# EAGLE design h2oiq_v4 (EAGLE 6.3)
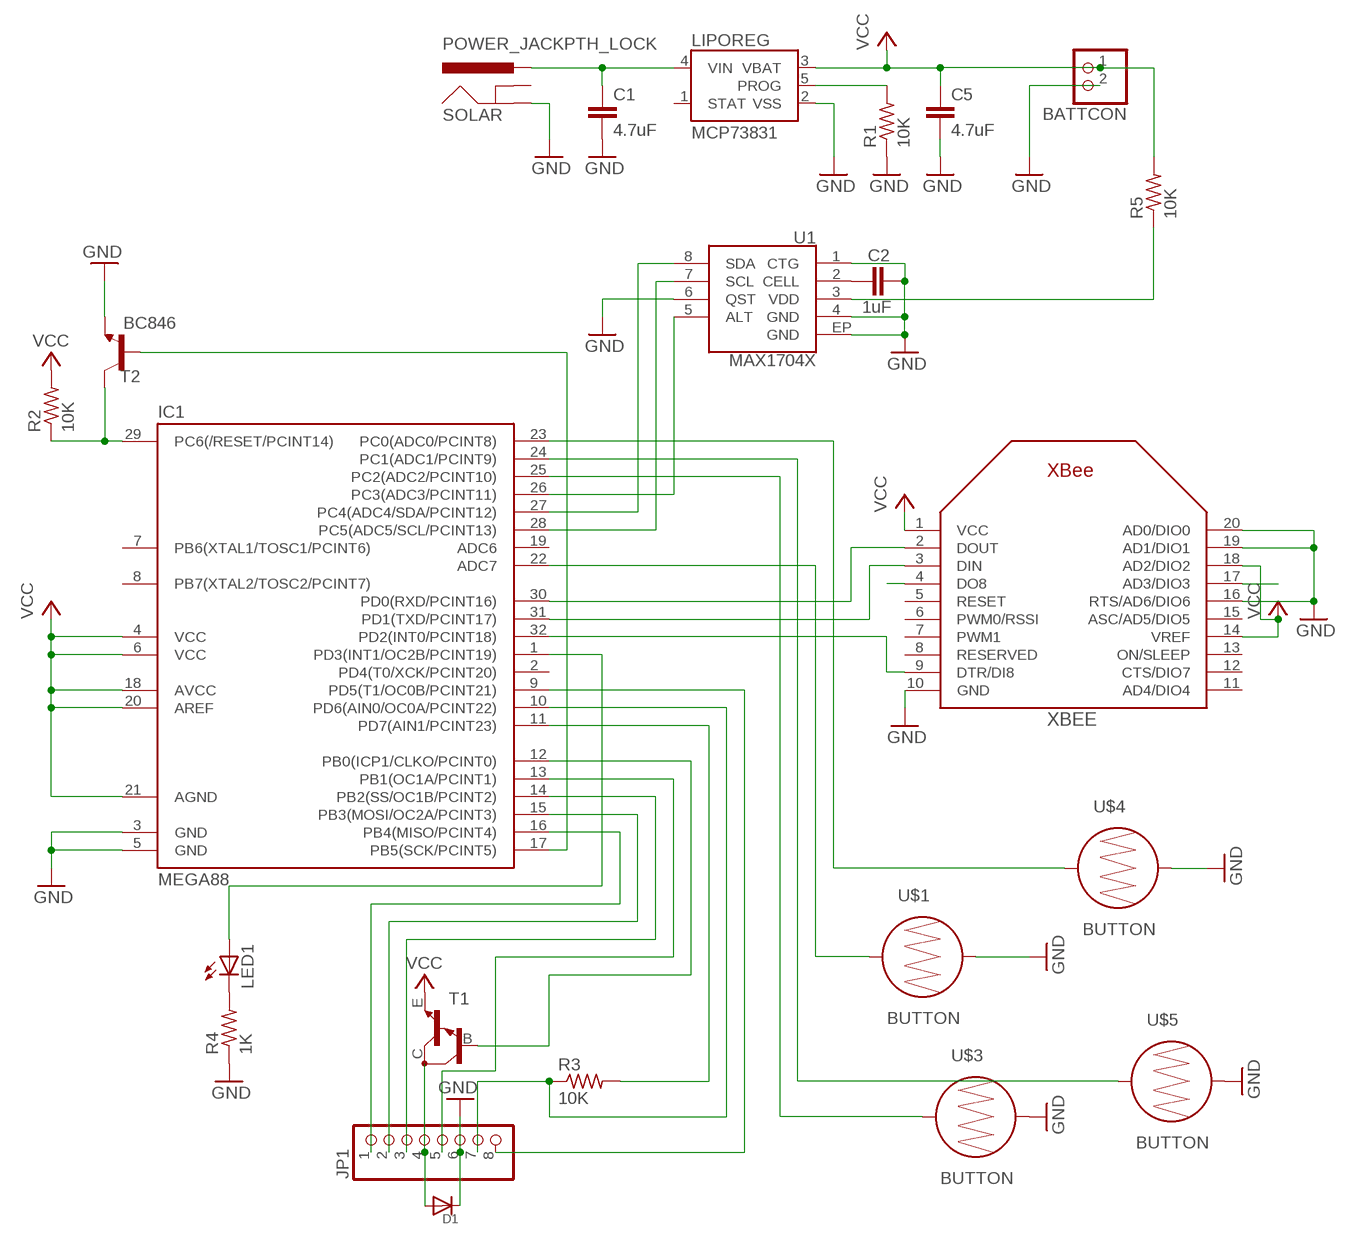
[diagram p0: schematic, sheet 1]

## Parts
BATTCON  JST_2PIN-SMT  [JST-PH-2-SMT]
C1  4.7uF  CAP0402-CAP  [0402-CAP]
C2  1uF  CAP0402-CAP  [0402-CAP]
C5  4.7uF  CAP0402-CAP  [0402-CAP]
D1  DIODESMA  [SMADIODE]
IC1  MEGA88  MEGA48/88/168-MU  [MLF32]
JP1  PINHD-1X8LOCK  [1X08-LOCK]
LED1  LED  [SMARTLED-TTW]
LIPOREG  MCP73831  [SOT23-5]
R1  10K  R-US_R0603  [R0603]
R2  10K  R-US_R0603  [R0603@1]
R3  10K  R-US_R0603  [R0603]
R4  1K  R-US_R0603  [R0603@1]
R5  10K  R-US_R0603  [R0603@1]
SOLAR  POWER_JACKPTH_LOCK  [POWER_JACK_PTH_LOCK]
T1  MMBTA13LT1-NPN_DARL-SOT23-BEC  [SOT23-BEC]
T2  BC846  [SOT23]
U1  MAX1704X  [TDFN-8]
U$1  BUTTON  BUTTON-CONDUCTIVESMD  [BUTTON-CONDUCTIVE]
U$3  BUTTON  BUTTON-CONDUCTIVESMD  [BUTTON-CONDUCTIVE]
U$4  BUTTON  BUTTON-CONDUCTIVESMD  [BUTTON-CONDUCTIVE]
U$5  BUTTON  BUTTON-CONDUCTIVESMD  [BUTTON-CONDUCTIVE]
XBEE  XBEE  [XBEE]

## Nets
GND: BATTCON.2 C1.2 C2.2 C5.2 D1.C IC1.3(GND) IC1.5(GND) JP1.6 LIPOREG.2(VSS) R1.1 R4.1 SOLAR.GND T2.2(E) U1.1(CTG) U1.4(GND) U1.6(QST) U1.EP(GND) U$1.2 U$3.2 U$4.2 U$5.2 XBEE.10(GND) XBEE.16(RTS/AD6/DIO6) XBEE.19(AD1/DIO1) XBEE.20(AD0/DIO0)
MAX1704ALT: IC1.26(PC3(ADC3/PCINT11)) U1.5(ALT)
MAX1704VDD: R5.1 U1.3(VDD) XBEE.4(DO8)
N$1: C1.1 LIPOREG.4(VIN) SOLAR.PWR
N$2: LIPOREG.5(PROG) R1.2
N$3: IC1.29(PC6(/RESET/PCINT14)) R2.1 T2.3(C)
N$4: IC1.12(PB0(ICP1/CLKO/PCINT0)) T1.B
N$6: IC1.27(PC4(ADC4/SDA/PCINT12)) U1.8(SDA)
N$7: IC1.28(PC5(ADC5/SCL/PCINT13)) U1.7(SCL)
N$8: IC1.32(PD2(INT0/PCINT18)) XBEE.9(DTR/DI8)
N$9: IC1.15(PB3(MOSI/OC2A/PCINT3)) JP1.2
N$10: IC1.1(PD3(INT1/OC2B/PCINT19)) LED1.A@1(A)
N$11: LED1.C@1(C) R4.2
N$12: IC1.23(PC0(ADC0/PCINT8)) U$4.1
N$13: IC1.14(PB2(SS/OC1B/PCINT2)) JP1.3
N$14: IC1.16(PB4(MISO/PCINT4)) JP1.1
N$15: IC1.10(PD6(AIN0/OC0A/PCINT22)) JP1.7 R3.1
N$16: IC1.25(PC2(ADC2/PCINT10)) U$3.1
N$17: IC1.30(PD0(RXD/PCINT16)) XBEE.2(DOUT)
N$18: IC1.22(ADC7) U$1.1
N$19: IC1.31(PD1(TXD/PCINT17)) XBEE.3(DIN)
N$20: IC1.24(PC1(ADC1/PCINT9)) U$5.1
N$23: C2.1 U1.2(CELL)
N$26: IC1.13(PB1(OC1A/PCINT1)) JP1.5
N$27: IC1.11(PD7(AIN1/PCINT23)) R3.2
N$28: IC1.9(PD5(T1/OC0B/PCINT21)) JP1.8
N$29: IC1.17(PB5(SCK/PCINT5)) T2.1(B)
SERVOACT: D1.A JP1.4 T1.C XBEE.17(AD3/DIO3)
VCC: BATTCON.1 C5.1 IC1.4(VCC) IC1.6(VCC) IC1.18(AVCC) IC1.20(AREF) IC1.21(AGND) LIPOREG.3(VBAT) R2.2 R5.2 T1.E XBEE.1(VCC) XBEE.14(VREF) XBEE.18(AD2/DIO2)
Unconnected: IC1.2(PD4(T0/XCK/PCINT20)) IC1.7(PB6(XTAL1/TOSC1/PCINT6)) IC1.8(PB7(XTAL2/TOSC2/PCINT7)) IC1.19(ADC6) LIPOREG.1(STAT) SOLAR.GNDBREAK XBEE.5(RESET) XBEE.6(PWM0/RSSI) XBEE.7(PWM1) XBEE.8(RESERVED) XBEE.11(AD4/DIO4) XBEE.12(CTS/DIO7) XBEE.13(ON/SLEEP) XBEE.15(ASC/AD5/DIO5)

## Library data of the parts
BATTCON = adafruit:JST_2PIN: JST 2-Pin Connectors of various flavors SMT-RA (S2B-PH-SM4) 4UConnector #17311 SMT (B2B-PH-SM4) THM-RA (S2B-PH) THM (B2B-PH)
C1 C2 C5 = SparkFun:CAP: Capacitor Standard 0603 ceramic capacitor, and 0.1" leaded capacitor.
D1 = adafruit:DIODE: Diode SMADIODE - SMA Surface Mount Package 20V 1A Schottky Diode Digikey: 641-1014-6-ND DO-1N4148 - Through Hole Small Current Diode SOD-123 20V 1 A (.5mV Vf) Schottky Diode - Digikey: MBRX120TPMSCT-ND SOD-323 10V 570mA (.38mV Vf, 3ns) Schottky Diode - Digikey: ZLLS410CT-ND SOD-523 30V 30mA Schottky Diode (RB751S-40TE61) - Digikey: RB751S-40TE61CT-ND SOT23-R/W - SOT23 Package (R = Solder Paste/Reflow Ovens, W = Hand-Soldering) BAT54Film 40V 300mA - Digikey: 497-7162-1-ND
IC1 = avr-7:MEGA48/88/168
JP1 = adafruit:PINHD-1X8: PIN HEADER
LED1 = led:LED: LED OSRAM: - CHIPLED LG R971, LG N971, LY N971, LG Q971, LY Q971, LO R971, LY R971 LH N974, LH R974 LS Q976, LO Q976, LY Q976 LO Q996 - Hyper CHIPLED LW Q18S LB Q993, LB Q99A, LB R99A - SideLED LS A670, LO A670, LY A670, LG A670, LP A670 LB A673, LV A673, LT A673, LW A673 LH A674 LY A675 LS A676, LA A676, LO A676, LY A676, LW A676 LS A679, LY A679, LG A679 - Hyper Micro SIDELED® LS Y876, LA Y876, LO Y876, LY Y876 LT Y87S - SmartLED LW L88C, LW L88S LB L89C, LB L89S, LG L890 LS L89K, LO L89K, LY L89K LS L896, LA L896, LO L896, LY L896 - TOPLED LS T670, LO T670, LY T670, LG T670, LP T670 LSG T670, LSP T670, LSY T670, LOP T670, LYG T670 LG T671, LOG T671, LSG T671 LB T673, LV T673, LT T673, LW T673 LH T674 LS T676, LA T676, LO T676, LY T676, LB T676, LH T676, LSB T676, LW T676 LB T67C, LV T67C, LT T67C, LS T67K, LO T67K, LY T67K, LW E67C LS E67B, LA E67B, LO E67B, LY E67B, LB E67C, LV E67C, LT E67C LW T67C LS T679, LY T679, LG T679 LS T770, LO T770, LY T770, LG T770, LP T770 LB T773, LV T773, LT T773, LW T773 LH T774 LS E675, LA E675, LY E675, LS T675 LS T776, LA T776, LO T776, LY T776, LB T776 LHGB T686 LT T68C, LB T68C - Hyper Mini TOPLED® LB M676 - Mini TOPLED Santana® LG M470 LS M47K, LO M47K, LY M47K Source: http://www.osram.convergy.de LUXEON: - LUMILED® LXK2-PW12-R00, LXK2-PW12-S00, LXK2-PW14-U00, LXK2-PW14-V00 LXK2-PM12-R00, LXK2-PM12-S00, LXK2-PM14-U00 LXK2-PE12-Q00, LXK2-PE12-R00, LXK2-PE12-S00, LXK2-PE14-T00, LXK2-PE14-U00 LXK2-PB12-K00, LXK2-PB12-L00, LXK2-PB12-M00, LXK2-PB14-N00, LXK2-PB14-P00, LXK2-PB14-Q00 LXK2-PR12-L00, LXK2-PR12-M00, LXK2-PR14-Q00, LXK2-PR14-R00 LXK2-PD12-Q00, LXK2-PD12-R00, LXK2-PD12-S00 LXK2-PH12-R00, LXK2-PH12-S00 LXK2-PL12-P00, LXK2-PL12-Q00, LXK2-PL12-R00 Source: www.luxeon.com KINGBRIGHT: KA-3528ASYC Source: www.kingbright.com
LIPOREG = SparkFun:MCP73831: Microchip's MCP73831 Miniature single cell, fully integrated Li-Ion, Li-polymer charge management controller http://ww1.microchip.com/downloads/en/DeviceDoc/21984a.pdf
R1 R3 = resistor:R-US_: RESISTOR, American symbol
R2 R4 R5 = rcl:R-US_: RESISTOR, American symbol
SOLAR = SparkFun:POWER_JACK: Power Jack This is the standard 5.5mm barrel jack for power. The PTH is the most common, proven, reliable, footprint. All others are experimental. The Slot footprint only works if the mill layer is transmitted to the PCB fab house so be warned. Spark Fun Electronics SKU : PRT-00119. Mating wall wart : TOL-00298 (and others)
T1 = transistor:*-NPN_DARL-: NPN Darlington Transistor
T2 = transistor:BC846: NPN TRANSISTOR
U1 = SparkFun:MAX1704X: MAX17043/MAX17044: Battery Fuel Guage (43 is 1cell, 44 is 2cell)
U$1 U$3-U$5 = SparkFun:BUTTON-CONDUCTIVE: Conductive Button Used with rubber key pads. This one was designed and proven to work with the PolyCase Key FOB enclosures.
XBEE = adafruit:XBEE

## Board
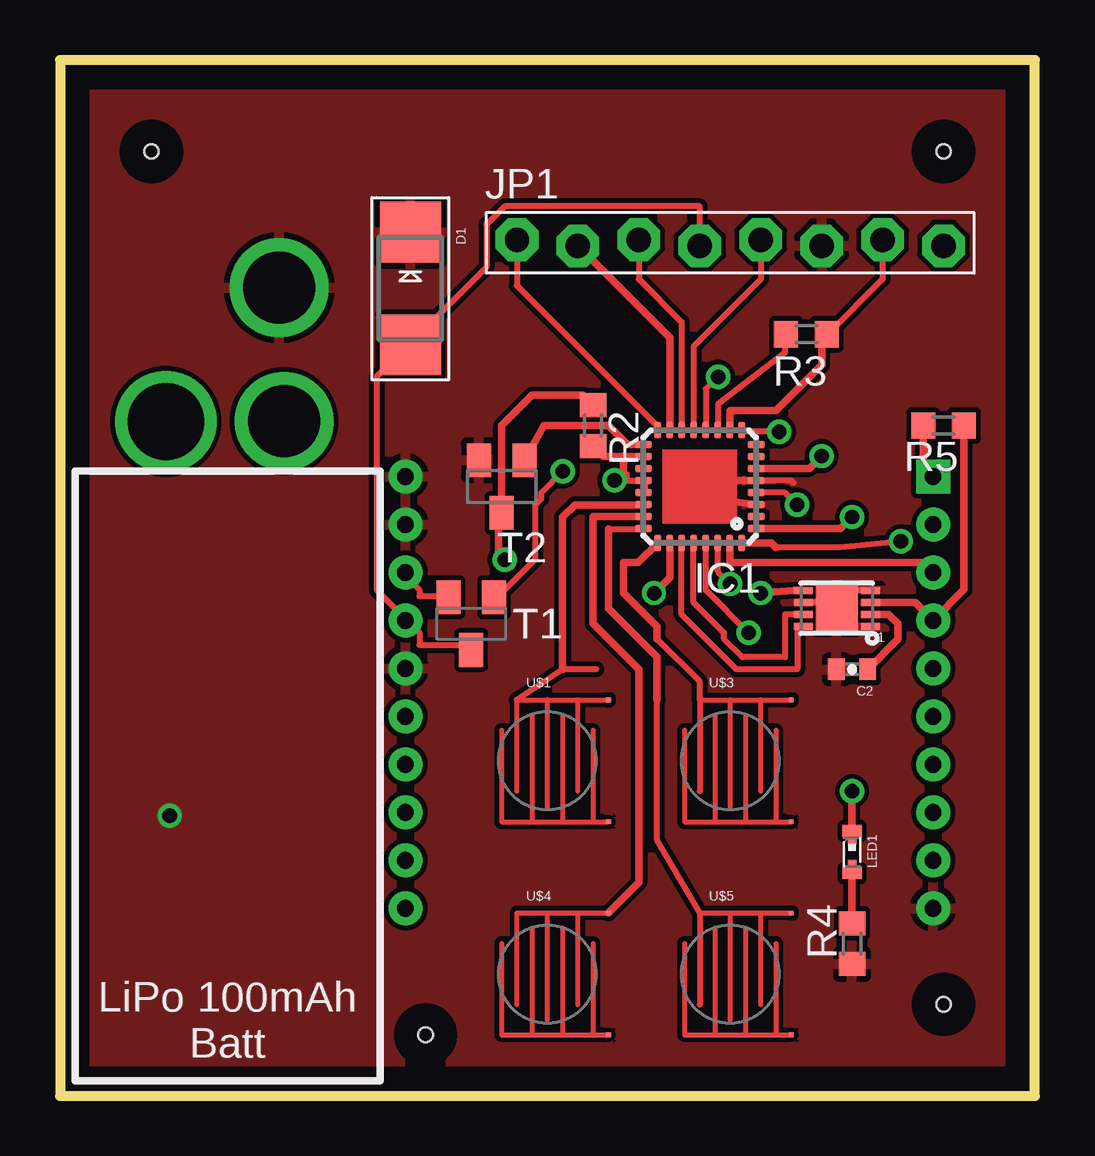
[diagram p1: board, top side]
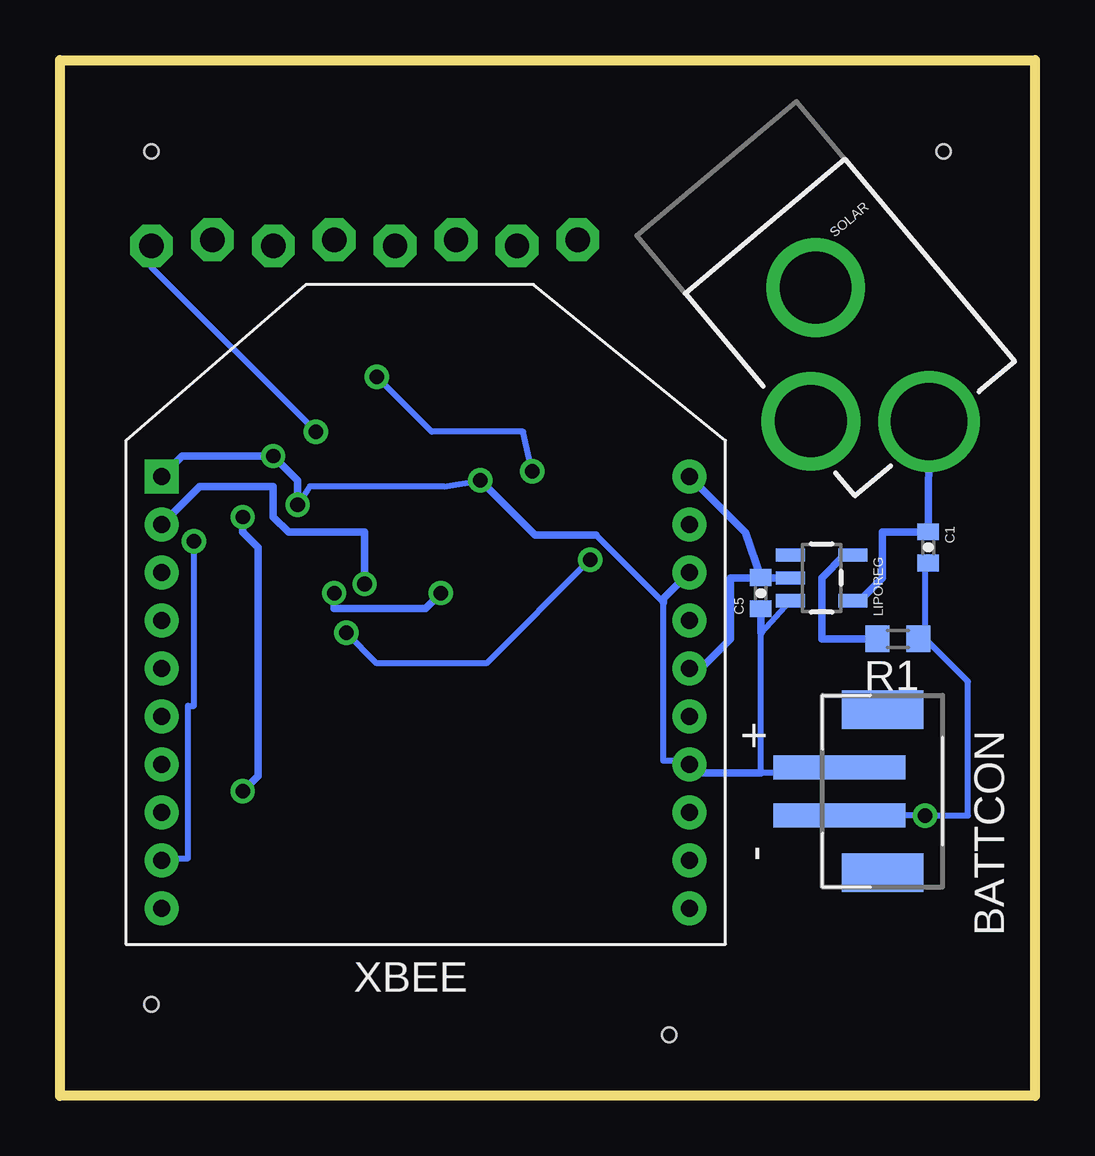
[diagram p2: board, bottom side, seen from below]

Size 40.64 x 43.18 mm. Coordinates in mm from the lower left corner, seen from the top.
Outline: 0,0 40.64,0 40.64,43.18 0,43.18 0,0
Copper layers (1*16): Top 0.035mm / dielectric 1.5mm / Bottom 0.035mm
Design rules "default": minimum track width 10mil, minimum drill 24mil, track to track 8mil, track to pad 8mil, pad to pad 8mil, via to via 8mil, smd to smd 8mil, copper to edge 40mil, drill to drill 8mil, minimum pad ring 10mil, minimum via ring 8mil, stop-mask expansion 4mil, vias tented up to drill 0mil, thermal gap 10mil
Holes 0.6 mm at 3.81,39.37 36.83,39.37 15.24,2.54 36.83,3.81

### Footprints (pad centres in the part's own frame; a part is rotated, then mirrored left to right if it is on the bottom)
JST-PH-2-SMT = smd 1 x 5.5: 1 -1,-1.8; 2 1,-1.8 | smd 1.6 x 3.4: NC1 -3.4,0; NC2 3.4,0
0402-CAP = smd 0.7 x 0.9: 1 -0.65,0; 2 0.65,0
SMADIODE = smd 2.54 x 2.54: A 2.349,0; C -2.349,0
MLF32 = smd 0.7 x 0.3: 1 -2.35,1.75; 2 -2.35,1.25; 3 -2.35,0.75; 4 -2.35,0.25; 5 -2.35,-0.25; 6 -2.35,-0.75; 7 -2.35,-1.25; 8 -2.35,-1.75; 17 2.35,-1.75; 18 2.35,-1.25; 19 2.35,-0.75; 20 2.35,-0.25; 21 2.35,0.25; 22 2.35,0.75; 23 2.35,1.25; 24 2.35,1.75 | smd 0.3 x 0.7: 9 -1.75,-2.35; 10 -1.25,-2.35; 11 -0.75,-2.35; 12 -0.25,-2.35; 13 0.25,-2.35; 14 0.75,-2.35; 15 1.25,-2.35; 16 1.75,-2.35; 25 1.75,2.35; 26 1.25,2.35; 27 0.75,2.35; 28 0.25,2.35; 29 -0.25,2.35; 30 -0.75,2.35; 31 -1.25,2.35; 32 -1.75,2.35
1X08-LOCK = drill 1.016 pad 1.778 octagon: 1 -8.89,0.127; 2 -6.35,-0.127; 3 -3.81,0.127; 4 -1.27,-0.127; 5 1.27,0.127; 6 3.81,-0.127; 7 6.35,0.127; 8 8.89,-0.127
SMARTLED-TTW = smd 0.8 x 0.5: A 0,-0.875; C 0,0.875 | smd 0.35 x 0.35: A@1 0,-0.5; C@1 0,0.5
SOT23-5 = smd 0.55 x 1.2: 1 -0.95,-1.3; 2 0,-1.3; 3 0.95,-1.3; 4 0.95,1.3; 5 -0.95,1.3
R0603 = smd 1 x 1.1: 1 -0.85,0; 2 0.85,0
POWER_JACK_PTH_LOCK = drill 2.997 pad 4.115: GND 0.025,6.557; GNDBREAK 3.762,10.7 | drill 3.2 pad 4.115: PWR 0,13.878
SOT23-BEC = smd 1 x 1.4: B -0.95,-1.1; C 0,1.1; E 0.95,-1.1
SOT23 = smd 1 x 1.4: 1 -0.95,-1.1; 2 0.95,-1.1; 3 0,1.1
TDFN-8 = smd 0.8 x 0.3: 1 -1.4,0.75; 2 -1.4,0.25; 3 -1.4,-0.25; 4 -1.4,-0.75; 5 1.4,-0.75; 6 1.4,-0.25; 7 1.4,0.25; 8 1.4,0.75 | smd 1.73 x 1.88: EP 0,0
BUTTON-CONDUCTIVE = smd 0.203 x 0.203: 1 2.54,2.54; 2 2.54,-2.54
XBEE = drill 0.7 pad 1.422 square: 1 -11,5.5 | drill 0.7 pad 1.422: 2 -11,3.5; 3 -11,1.5; 4 -11,-0.5; 5 -11,-2.5; 6 -11,-4.5; 7 -11,-6.5; 8 -11,-8.5; 9 -11,-10.5; 10 -11,-12.5; 11 11,-12.5; 12 11,-10.5; 13 11,-8.5; 14 11,-6.5; 15 11,-4.5; 16 11,-2.5; 17 11,-0.5; 18 11,1.5; 19 11,3.5; 20 11,5.5

### Placement (x,y rotation side)
BATTCON  6.35,12.7 270 bottom
C1  4.45,22.86 270 bottom
C2  33.02,17.78 180 top
C5  11.43,20.95 90 bottom
D1  14.61,33.66 270 top
IC1  26.67,25.4 180 top
JP1  27.94,35.56 0 top
LED1  33.02,10.16 180 top
LIPOREG  8.89,21.59 270 bottom
R1  5.71,19.05 180 bottom
R2  10K  [R0603]  22.23,27.94 270 top
R3  31.11,31.75 180 top
R4  1K  [R0603]  33.02,6.35 90 top
R5  10K  [R0603]  36.83,27.94 180 top
SOLAR  13.34,38.73 220 bottom
T1  17.14,19.68 180 top
T2  18.41,25.4 180 top
U1  32.38,20.32 180 top
U$1  20.32,13.97 0 top
U$3  27.94,13.97 0 top
U$4  20.32,5.08 0 top
U$5  27.94,5.08 0 top
XBEE  25.4,20.32 0 bottom

### Tracks (layer width: path | path; a pad name or v marks a point on that pad's centre or on a via)
GND  (via drill 0.61)
  Top 0.254: 28.96,25.65 IC1.5 29.21,25.65 30.48,25.65 30.57,25.55 | 32.51,20.57 32.51,20.32 U1.EP 32.51,20.57 | 32.51,20.57 U1.6 | 28.96,24.64 IC1.3 29.21,24.64 | 32.51,20.57 32.51,21.08 33.78,21.08 U1.4
  Top 0.305: 29.21,25.65 28.19,25.65 27.94,25.4 27.94,24.77 IC1.3
  Bottom 0.254: BATTCON.2 8.13,11.68 v4.57,11.68 2.79,11.68 2.79,17.27 4.57,19.05 | 4.57,19.05 4.57,22.1 C1.2 | 4.57,19.05 R1.1 4.83,19.05
  Bottom 0.305: LIPOREG.2 12.05,21.59 | 12.05,21.59 C5.2 12.06,23.48 XBEE.20 | XBEE.16 13.93,17.82 12.7,19.05 12.7,21.59 12.05,21.59
  pour Top: -1.27,43.18 -1.27,-1.27 41.91,-1.27 41.91,43.18
MAX1704ALT  (via drill 0.6)
  Top 0.305: IC1.26 25.42,21.61 v24.77,20.95 | U1.5 30.59,21.07 v29.21,20.95
  Bottom 0.305: v24.77,20.95 25.4,20.32 29.21,20.32 v29.21,20.95
MAX1704VDD
  Top 0.305: U1.3 35.65,20.57 XBEE.4 37.68,21.1 R5.1
N$1
  Bottom 0.305: SOLAR.PWR C1.1 4.46,23.5 6.35,23.5 6.35,21.59 7.3,20.64 LIPOREG.4
N$2
  Bottom 0.305: LIPOREG.5 7.94,22.54 8.89,21.59 8.89,19.05 R1.2
N$3  (via drill 0.61)
  Top 0.254: v28.7,19.3 26.92,21.08 26.92,22.86 IC1.29 | 22.1,28.7 R2.1 | 18.29,24.13 T2.3
  Top 0.305: T2.3 18.41,27.94 19.68,29.21 21.8,29.21 R2.1 | 18.29,24.13 18.29,22.61 v18.54,22.35
  Bottom 0.254: v28.7,19.3 27.43,18.03 22.86,18.03 v18.54,22.35
N$4  (via drill 0.61)
  Top 0.254: v27.43,29.97 26.92,29.46 26.92,27.94 IC1.12 | v20.95,26.04 20.07,25.15 20.07,24.89 19.81,24.64 19.81,22.35 18.29,20.83 T1.B
  Bottom 0.254: v27.43,29.97 25.15,27.69 21.34,27.69 v20.95,26.04
N$6
  Top 0.254: IC1.27 25.91,22.86 25.91,20.07 28.19,17.78 30.73,17.78 30.73,19.56 U1.8
N$7
  Top 0.254: IC1.28 26.42,22.86 26.42,20.57 27.69,19.3 27.69,19.05 28.45,18.29 30.23,18.29 30.23,20.07 30.73,20.07 U1.7
N$8  (via drill 0.61)
  Top 0.254: 29.84,22.86 32.51,22.86 v35.05,23.11
  Top 0.305: IC1.32 29.66,23.05 29.84,22.86
  Bottom 0.254: XBEE.9 36.32,9.91 35.31,9.91 35.31,16.26 35.05,16.26 v35.05,23.11
N$9
  Top 0.305: IC1.15 25.42,31.6 JP1.2
N$10  (via drill 0.6)
  Top 0.305: IC1.1 32.54,23.65 v33.02,24.13 | LED1.A@1 v33.02,12.7
  Bottom 0.305: v33.02,24.13 33.02,23.5 32.38,22.86 32.38,13.34 v33.02,12.7
N$11
  Top 0.305: R4.2 LED1.C@1
N$12
  Top 0.305: IC1.23 22.25,24.15 22.23,24.13 22.23,19.68 24.13,17.78 24.13,8.89 U$4.1
N$13
  Top 0.254: JP1.3 24.13,34.04 25.91,32.26 25.91,27.94 IC1.14
N$14
  Top 0.254: JP1.1 19.05,33.78 24.89,27.94 IC1.16
N$15
  Top 0.254: JP1.7 34.29,34.04 32,31.75 R3.1
  Top 0.305: IC1.10 27.92,28.55 27.94,28.57 29.84,28.57 31.75,30.48 31.75,31.54 R3.1
N$16
  Top 0.254: 24.89,19.05 26.67,17.27 26.67,16.51 26.67,12.7 | 24.89,22.86 IC1.25
  Top 0.305: 24.89,19.05 24.89,19.56 23.5,20.95 23.5,22.23 24.09,22.23 IC1.25
N$17  (via drill 0.61)
  Top 0.254: v27.94,21.34 27.43,21.84 27.43,22.86 IC1.30
  Bottom 0.305: v27.94,21.34 27.94,23.5 31.11,23.5 31.75,24.13 31.75,25.4 34.82,25.4 XBEE.2
N$18
  Top 0.254: 24.13,24.64 IC1.22 | 22.35,17.78 20.95,17.78 19.05,16.51
  Top 0.305: 24.13,24.64 21.46,24.64 20.95,24.13 20.95,17.78
N$19
  Top 0.305: IC1.31 27.92,22.25 27.94,22.23 35.99,22.23 XBEE.3
N$20
  Top 0.254: 22.86,23.62 24.13,23.62 IC1.24 | 24.89,16.51 24.89,10.67 26.67,7.62 26.67,3.81
  Top 0.305: 24.89,16.51 24.89,18.29 22.86,20.32 22.86,23.62
N$23
  Top 0.305: U1.2 34.54,20.07 34.92,19.68 34.92,19.04 C2.1
N$26
  Top 0.254: JP1.5 29.21,34.04 26.42,31.24 26.42,27.94 IC1.13
N$27
  Top 0.254: IC1.11 27.43,27.94 27.43,28.83 30.23,30.99 30.23,31.75 R3.2
N$28  (via drill 0.61)
  Top 0.254: v29.97,27.69 28.45,27.69 IC1.9
  Bottom 0.254: v29.97,27.69 36.83,34.54 JP1.8
N$29
  Top 0.305: IC1.17 23.65,27.15 22.86,27.94 20.17,27.94 T2.1
SERVOACT
  Top 0.254: JP1.4 26.67,37.08 18.54,37.08 17.78,36.32 17.78,34.54 14.73,31.5 D1.A 14.48,31.24 13.21,29.97 13.21,21.08 14.22,20.07 XBEE.17 14.48,19.81 14.99,19.3 14.99,18.8 17.02,18.8 T1.C
VCC  (via drill 0.6, 0.61)
  Top 0.254: IC1.21 24.38,25.15 24.38,25.65 IC1.20 24.13,25.65 23.62,25.65 23.62,25.91 23.5,25.98 23.37,25.91 v23.11,25.65 | 28.96,26.16 IC1.6 | 28.96,25.15 IC1.4 29.21,25.15 30.23,25.15 v30.73,24.64 | T1.E 16,20.83 14.99,20.83 14.99,21.08 14.48,21.59 XBEE.18
  Top 0.305: R2.2 22.66,26.65 IC1.18 23.52,26.65 23.5,26.67 23.5,25.98 | 36.07,26.15 XBEE.1 35.98,26.24 R5.2 | IC1.6 31.23,26.15 v31.75,26.67
  Bottom 0.254: BATTCON.1 8.38,13.46 11.43,13.46 11.43,19.3 LIPOREG.3 | XBEE.14 14.48,13.97 15.49,13.97 15.49,20.57 18.29,23.37 | v30.73,24.64 30.23,25.4 24.64,25.4 v23.11,25.65
  Bottom 0.305: 11.43,19.3 C5.1 | 11.43,13.46 14.04,13.46 XBEE.14 | 15.49,20.57 15.49,20.73 XBEE.18 | v30.73,24.64 30.73,25.65 v31.75,26.67 35.55,26.67 XBEE.1 | 18.29,23.37 20.83,23.37 v23.11,25.65

### Text on the board
tPlace: LiPo 100mAh / Batt